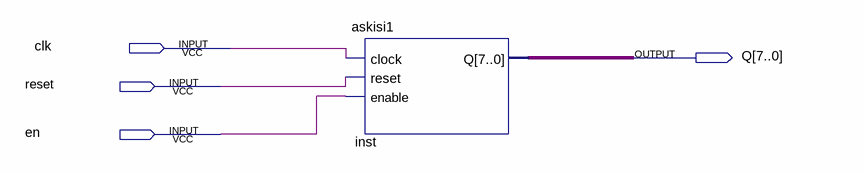
[diagram p0: schematic sheet]
// Quartus schematic Block1.bdf as structural Verilog: 1 symbols, 4 pins
module Block1 (
  input  clk,
  input  reset,
  input  en,
  output [7:0] Q
);

  askisi1 inst (.clock(clk), .reset(reset), .enable(en), .Q(Q));
endmodule
